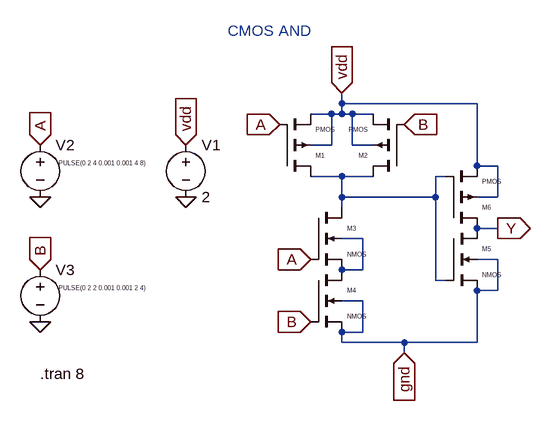
[diagram p0: schematic CMOS AND.asc]
CMOS AND.asc, the LTspice schematic file:
Version 4
SHEET 1 880 680
WIRE 240 32 240 16
WIRE 448 32 240 32
WIRE 224 48 192 48
WIRE 240 48 240 32
WIRE 240 48 224 48
WIRE 256 48 240 48
WIRE 288 48 256 48
WIRE 224 96 224 48
WIRE 224 96 192 96
WIRE 256 96 256 48
WIRE 288 96 256 96
WIRE 448 128 448 32
WIRE 480 128 448 128
WIRE 240 144 192 144
WIRE 288 144 240 144
WIRE 400 144 384 144
WIRE 240 176 240 144
WIRE 384 176 384 144
WIRE 384 176 240 176
WIRE 480 176 480 128
WIRE 480 176 448 176
WIRE 240 192 240 176
WIRE 480 224 448 224
WIRE 272 240 240 240
WIRE 480 272 448 272
WIRE 272 288 272 240
WIRE 272 288 240 288
WIRE 384 304 384 176
WIRE 400 304 384 304
WIRE 480 320 480 272
WIRE 480 320 448 320
WIRE 272 336 240 336
WIRE 272 384 272 336
WIRE 272 384 240 384
WIRE 240 400 240 384
WIRE 336 400 240 400
WIRE 448 400 448 320
WIRE 448 400 336 400
WIRE 336 416 336 400
FLAG 240 16 vdd
IOPIN 240 16 In
FLAG 0 96 vdd
IOPIN 0 96 In
FLAG 144 64 A
IOPIN 144 64 In
FLAG -224 96 A
IOPIN -224 96 In
FLAG 192 272 A
IOPIN 192 272 In
FLAG 336 64 B
IOPIN 336 64 In
FLAG -224 288 B
IOPIN -224 288 In
FLAG 192 368 B
IOPIN 192 368 In
FLAG 0 176 0
FLAG -224 176 0
FLAG -224 368 0
FLAG 480 224 Y
IOPIN 480 224 Out
FLAG 336 416 gnd
IOPIN 336 416 In
SYMBOL pmos4 144 144 M180
WINDOW 0 56 32 Left 0
WINDOW 3 56 72 Left 0
SYMATTR InstName M1
SYMBOL pmos4 336 144 R180
WINDOW 0 56 32 Left 0
WINDOW 3 56 72 Left 0
SYMATTR InstName M2
SYMBOL nmos4 192 192 R0
WINDOW 0 56 32 Left 0
WINDOW 3 56 72 Left 0
SYMATTR InstName M3
SYMBOL nmos4 192 288 R0
WINDOW 0 56 32 Left 0
WINDOW 3 56 72 Left 0
SYMATTR InstName M4
SYMBOL nmos4 400 224 R0
WINDOW 0 56 32 Left 0
WINDOW 3 56 72 Left 0
SYMATTR InstName M5
SYMBOL pmos4 400 224 M180
WINDOW 0 56 32 Left 0
WINDOW 3 56 72 Left 0
SYMATTR InstName M6
SYMBOL voltage 0 80 R0
WINDOW 123 0 0 Left 0
WINDOW 39 0 0 Left 0
SYMATTR InstName V1
SYMATTR Value 2
SYMBOL voltage -224 80 R0
WINDOW 3 96 50 Bottom 0
WINDOW 123 0 0 Left 0
WINDOW 39 0 0 Left 0
SYMATTR Value PULSE(0 2 4 0.001 0.001 4 8)
SYMATTR InstName V2
SYMBOL voltage -224 272 R0
WINDOW 3 96 50 Bottom 0
WINDOW 123 0 0 Left 0
WINDOW 39 0 0 Left 0
SYMATTR Value PULSE(0 2 2 0.001 0.001 2 4)
SYMATTR InstName V3
TEXT -224 448 Left 2 !.tran 8
TEXT 64 -80 Left 2 ;CMOS AND

The netlist it stands for:
* CMOS AND.asc
M1 N001 A vdd vdd PMOS
M2 N001 B vdd vdd PMOS
M3 N001 A N002 N002 NMOS
M4 N002 B gnd gnd NMOS
M5 Y N001 gnd gnd NMOS
M6 Y N001 vdd vdd PMOS
V1 vdd 0 2
V2 A 0 PULSE(0 2 4 0.001 0.001 4 8)
V3 B 0 PULSE(0 2 2 0.001 0.001 2 4)
.model NMOS NMOS
.model PMOS PMOS
.lib standard.mos
.tran 8
* CMOS AND
.backanno
.end

* Results of the author's LTspice run, read from the files saved beside the schematic
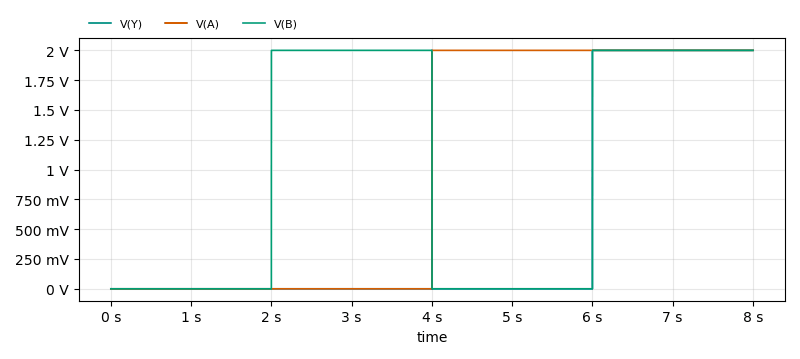
[diagram p1: Transient Analysis of CMOS AND.asc, plotted from the saved traces]
* Transient Analysis, 1 run:
*   V(Y): min 0 V, max 2 V, average 500.1 mV, rms 1 V, last 2 V
*   V(A): min 0 V, max 2 V, average 999.9 mV, rms 1.414 V, last 2 V
*   V(B): min 0 V, max 2 V, average 1 V, rms 1.414 V, last 2 V